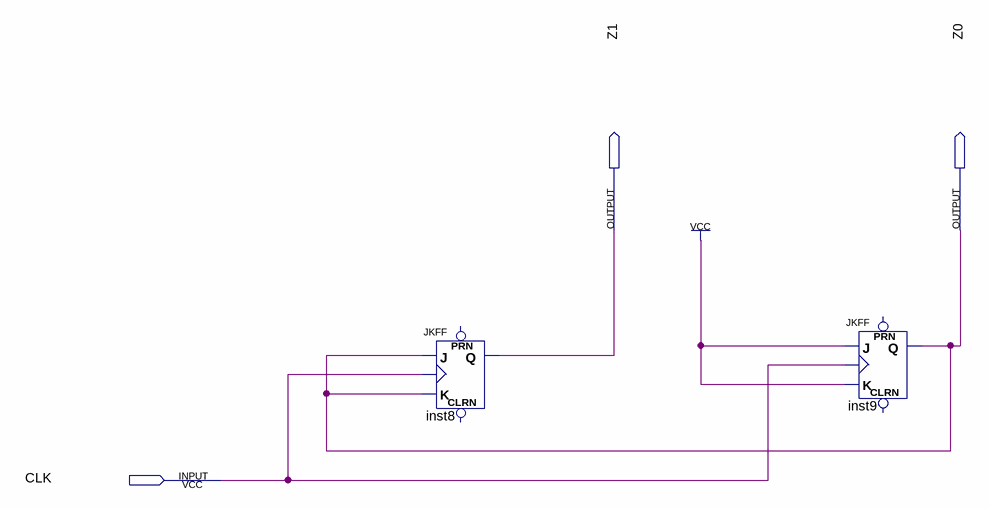
[diagram p0: schematic sheet]
// Quartus schematic Contador.bdf as structural Verilog: 2 symbols, 3 pins
module Contador (
  input  CLK,
  output Z1,
  output Z0
);

  JKFF inst8 (.K(Z0), .J(Z0), .CLK(CLK), .Q(Z1));  // open: PRN, CLRN
  JKFF inst9 (.K(1'b1), .J(1'b1), .CLK(CLK), .Q(Z0));  // open: PRN, CLRN
endmodule
